# Altium schematic sheet STM32f0DemoBoard.SchDoc: STM32F0 Demo Board
size A4; Author: Saeed Ghorbani; DrawnBy: Saeed Ghorbani; Revision: 1; SheetNumber: 1; SheetTotal: 1
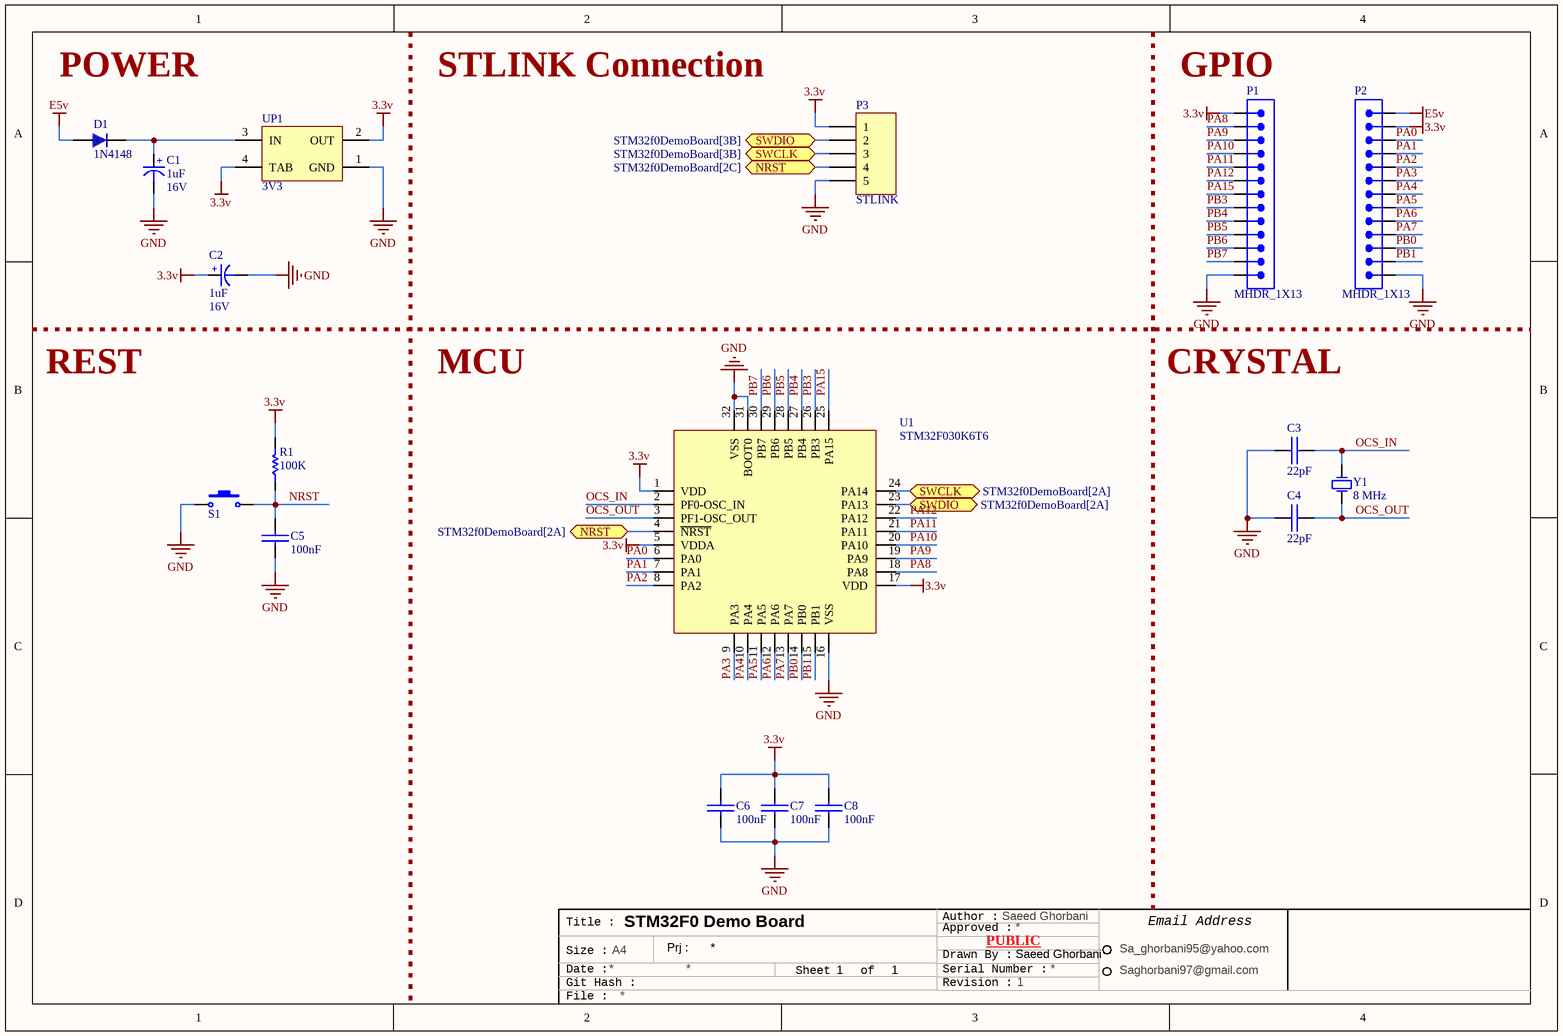
[diagram p0: STM32f0DemoBoard.SchDoc]

## Parts
C1  Voltage: 16V  [CAPP 1206 (3216X18L) Size A]  (hidden comment: 1uF)
C2  Voltage: 16V  [CAPP 1206 (3216X18L) Size A]  (hidden comment: 1uF)
C3  22pF  [SMD_CAP_1206]
C4  22pF  [SMD_CAP_1206]
C5  100nF  [SMD_CAP_1206]
C6  100nF  [SMD_CAP_1206]
C7  100nF  [SMD_CAP_1206]
C8  100nF  [SMD_CAP_1206]
D1  1N4148  [Diode 1n4148 SMD]
P1  MHDR_1X13  [MHDR1X13-254P]
P2  MHDR_1X13  [MHDR1X13-254P]
P3  STLINK  [HDR1X5]
R1  100K  [RES 1206 (3216X08L)]
S1  Switch PB  [Switch - Push to On]  (value not drawn)
U1  STM32F030K6T6  [LQFP-32]
UP1  3V3  [SOT223]
Y1  8 MHz  [CRYSTAL Small]

## Ports
NRST (bidir, see STM32f0DemoBoard[2A]), NRST (bidir, see STM32f0DemoBoard[2C]), SWCLK (bidir, see STM32f0DemoBoard[2A]), SWCLK (bidir, see STM32f0DemoBoard[3B]), SWDIO (bidir, see STM32f0DemoBoard[2A]), SWDIO (bidir, see STM32f0DemoBoard[3B])

## Nets
3.3v: C2.1(+) C6.1(+) C7.1(+) C8.1(+) P1.1 P2.2 P3.1 R1.2 U1.1(VDD) U1.5(VDDA) U1.17(VDD) UP1.2(OUT) UP1.4(TAB)
E5v: D1.1 P2.1
GND: C1.2(-) C2.2(-) C3.1(+) C4.1(+) C5.2(-) C6.2(-) C7.2(-) C8.2(-) P1.13 P2.13 P3.5 S1.1 U1.16(VSS) U1.31(BOOT0) U1.32(VSS) UP1.1(GND)
NRST: P3.4 U1.4(~{NRST}) ; port NRST
NRST: C5.1(+) R1.1 S1.2  [a separate net that carries the same name]
OCS_IN: C3.2(-) U1.2(PF0-OSC_IN) Y1.2(OSC2)
OCS_OUT: C4.2(-) U1.3(PF1-OSC_OUT) Y1.1(OSC1)
PA0: P2.3 U1.6(PA0)
PA1: P2.4 U1.7(PA1)
PA2: P2.5 U1.8(PA2)
PA3: P2.6 U1.9(PA3)
PA4: P2.7 U1.10(PA4)
PA5: P2.8 U1.11(PA5)
PA6: P2.9 U1.12(PA6)
PA7: P2.10 U1.13(PA7)
PA8: P1.2 U1.18(PA8)
PA9: P1.3 U1.19(PA9)
PA10: P1.4 U1.20(PA10)
PA11: P1.5 U1.21(PA11)
PA12: P1.6 U1.22(PA12)
PA15: P1.7 U1.25(PA15)
PB0: P2.11 U1.14(PB0)
PB1: P2.12 U1.15(PB1)
PB3: P1.8 U1.26(PB3)
PB4: P1.9 U1.27(PB4)
PB5: P1.10 U1.28(PB5)
PB6: P1.11 U1.29(PB6)
PB7: P1.12 U1.30(PB7)
SWCLK: P3.3 U1.24(PA14) ; port SWCLK
SWDIO: P3.2 U1.23(PA13) ; port SWDIO
NetC1_1: C1.1(+) D1.2 UP1.3(IN)

## Notes on the sheet
- POWER
- STLINK Connection
- (near P1) GPIO
- REST
- MCU
- CRYSTAL
- Title :
- Author :
- Email Address
- Size :
- Date :
- Git Hash :
- A4
- Prj :
- Sheet
- of
- Serial Number :
- Approved :
- Drawn By :
- Revision :
- PUBLIC
- Sa_ghorbani95@yahoo.com
- Saghorbani97@gmail.com
- File :

## Library data of the parts
C1 C2 = Cap-Polar: Polar Capacitor; Designer: Saeid Jorablo; Organazation: ControTec; Adding Date: 1387/12/20; Value: 1uF
C3-C8 = Cap-Bipolar: Bipolar Capacitor; Voltage: 100V; Designer: Saeid Jorablo; Organazation: ControTec; Adding Date: 1387/12/20
  C3 C4: Value: 22pF
  C5-C8: Value: 100nF
D1 = 1N4148 SMD: General Semicoductor
P1 P2 = MHDR_1X13: Male Header 1X13
P3 = Header 5: Header, 5-Pin; LatestRevisionDate: 17-Jul-2002; LatestRevisionNote: Re-released for DXP Platform.; Publisher: Altium Limited
R1 = Resistor: Tolerance: 5%; Power: 1/8 W; Value: 100K
S1 = Switch PB: Push Button Switch
U1 = STM32F030K6T6: STMICROELECTRONICS - STM32F030K6T6 - ARM MCU, Value Line, STM32 Family STM32F0 Series Microcontrollers, ARM Cortex-M0, 32bit, 48 MHz; Interface: I2C,SPI,UART,USART; Operating Supply Voltage: 3.3V; Data Bus Width: 32b; Memory Type: FLASH; Frequency: 48MHz; RAM Size: 4KB; Max Supply Voltage: 3.6V; Max Power Dissipation: 357mW; Number of I/Os: 26; Number of Timers/Counters: 5; Min Supply Voltage: 2.4V; Oscillator Type: Internal; Number of ADC Channels: 12; Number of SPI Channels: 1; Watchdog Timer: Yes; Memory Size: 32KB; Peripherals: POR,PWM,WDT,DMA; Supplier 1: Digi-Key; Manufacturer: STMicroelectronics; Manufacturer Part Number: STM32F030K6T6; RoHS: Yes; Category: Microcontrollers; Pricing 1: 1=1/84000, 10=1/65000, 25=1/55640, 80=1/32600, 250=1/24512, 500=1/08948, 1000=1/03760 (USD); Case/Package: LQFP; Number of Pins: 32; Weight: 0.027302oz; Contact Plating: Tin; Min Operating Temperature: -40°C; Max Operating Temperature: 85°C; Package Quantity: 250; Packaging: Tray; Core Architecture: ARM; Max Frequency: 48MHz; Number of I2C Channels: 1; Number of Programmable I/O: 26; Length: 7.2mm; Width: 7.2mm; Height: 1.45mm; Radiation Hardening: No; REACH SVHC: No SVHC; Lead Free: Lead Free; RoHS Compliant: Yes; ComponentLink1URL: https://datasheet.ciiva.com/29987/dm00088500-29987017.pdf?src-supplier=Avnet; ComponentLink1Description: https://datasheet.ciiva.com/29987/dm00088500-29987017.pdf?src-supplier=Avnet; ComponentLink2URL: https://datasheet.ciiva.com/46427/1792126-46427291.pdf?src-supplier=Element14; ComponentLink2Description: https://datasheet.ciiva.com/46427/1792126-46427291.pdf?src-supplier=Element14; Supplier Part Number 1: 497-14046-ND
UP1 = AMS1117-x.x: x.x Volt, 800mA Low-Dropout Linear Regulator, 4-pin SOT-223; Designer: Ali Hafizi; Data: 16-12-2016
Y1 = XTAL: XTAL Crystal; Designer: ABBAS BASEREH; Design Date: 2017-1-3; ComponentLink1Description: Datasheet; ComponentLink2Description: Reference; Mounting Technology: Surface Mount\Through-Hole; Value: 8 MHz; Status: Unreleased